# EAGLE design M_16PWM (EAGLE 6.4)
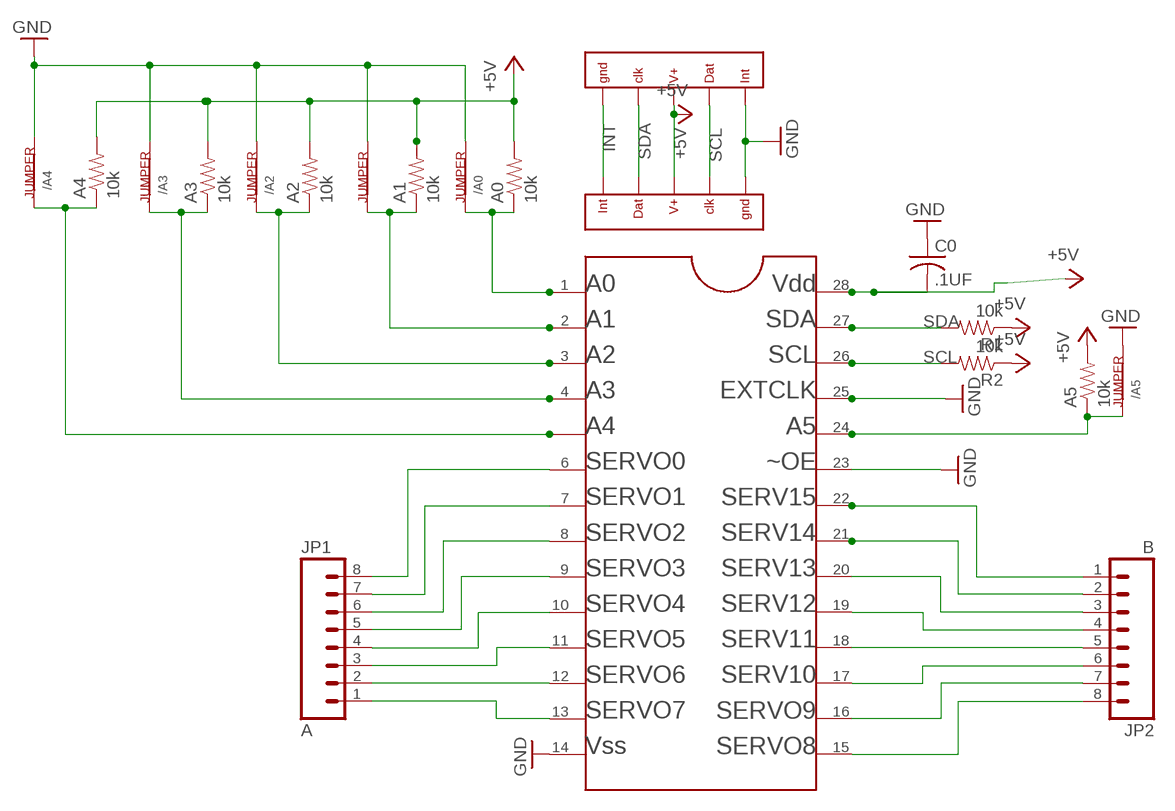
[diagram p0: schematic, sheet 1]

## Parts
/A0  JUMPER  [JUMPER]
/A1  JUMPER  [JUMPER]
/A2  JUMPER  [JUMPER]
/A3  JUMPER  [JUMPER]
/A4  JUMPER  [JUMPER]
/A5  JUMPER  [JUMPER]
A0  10k  RESISTOR0402-RES  [0402-RES]
A1  10k  RESISTOR0402-RES  [0402-RES]
A2  10k  RESISTOR0402-RES  [0402-RES]
A3  10k  RESISTOR0402-RES  [0402-RES]
A4  10k  RESISTOR0402-RES  [0402-RES]
A5  10k  RESISTOR0402-RES  [0402-RES]
C0  .1UF  C-USC0603  [C0603]
JP1  A  M081X08  [1X08]
JP2  B  M081X08  [1X08]
R1  10k  RESISTOR0402-RES  [0402-RES]
R2  10k  RESISTOR0402-RES  [0402-RES]
U$1  PCA9685PW  [TSSOP28]
U$2  050-5  [050-5]
U$3  050-5  [050-5]

## Nets
+5V: A0.2 A1.2 A2.2 A3.2 A4.2 A5.2 C0.2 R1.1 R2.1 U$1.28 U$2.P$3 U$3.P$3
GND: /A0.2 /A1.2 /A2.2 /A3.2 /A4.2 /A5.2 C0.1 U$1.14 U$1.23 U$1.25 U$2.P$5 U$3.P$1
INT: U$2.P$1 U$3.P$5
N$1: JP1.8 U$1.6
N$2: JP1.7 U$1.7
N$3: JP1.6 U$1.8
N$4: JP1.5 U$1.9
N$5: JP1.4 U$1.10
N$6: JP1.3 U$1.11
N$7: JP1.2 U$1.12
N$8: JP1.1 U$1.13
N$9: /A5.1 A5.1 U$1.24
N$10: JP2.8 U$1.15
N$11: JP2.7 U$1.16
N$12: JP2.6 U$1.17
N$13: JP2.5 U$1.18
N$14: JP2.4 U$1.19
N$15: JP2.3 U$1.20
N$16: JP2.1 U$1.22
N$17: JP2.2 U$1.21
N$19: /A0.1 A0.1 U$1.1
N$20: /A4.1 A4.1 U$1.5
N$21: /A2.1 A2.1 U$1.3
N$22: /A3.1 A3.1 U$1.4
N$23: /A1.1 A1.1 U$1.2
SCL: R2.2 U$1.26 U$2.P$4 U$3.P$2
SDA: R1.2 U$1.27 U$2.P$2 U$3.P$4

## Library data of the parts
/A0 /A1-/A5 = z_ML_stuff:JUMPER; ATT: r#
A0 A1-A5 R1 R2 = SparkFun-Resistors:RESISTOR: Resistor Basic schematic elements and footprints for 0603, 1206, and PTH resistors.
C0 = resistor:C-US: CAPACITOR, American symbol
JP1 JP2 = SparkFun-Connectors:M08: Header 8 Standard 8-pin 0.1" header. Use with straight break away headers (SKU : PRT-00116), right angle break away headers (PRT-00553), swiss pins (PRT-00743), machine pins (PRT-00117), and female headers (PRT-00115).
U$1 = SparkFun-DigitalIC:PCA9685PW: I2C_16-CHANNEL_LED_DRIVER http://www.nxp.com/documents/data_sheet/PCA9685.pdf
U$2 U$3 = zz-upenn:050-5

## Board
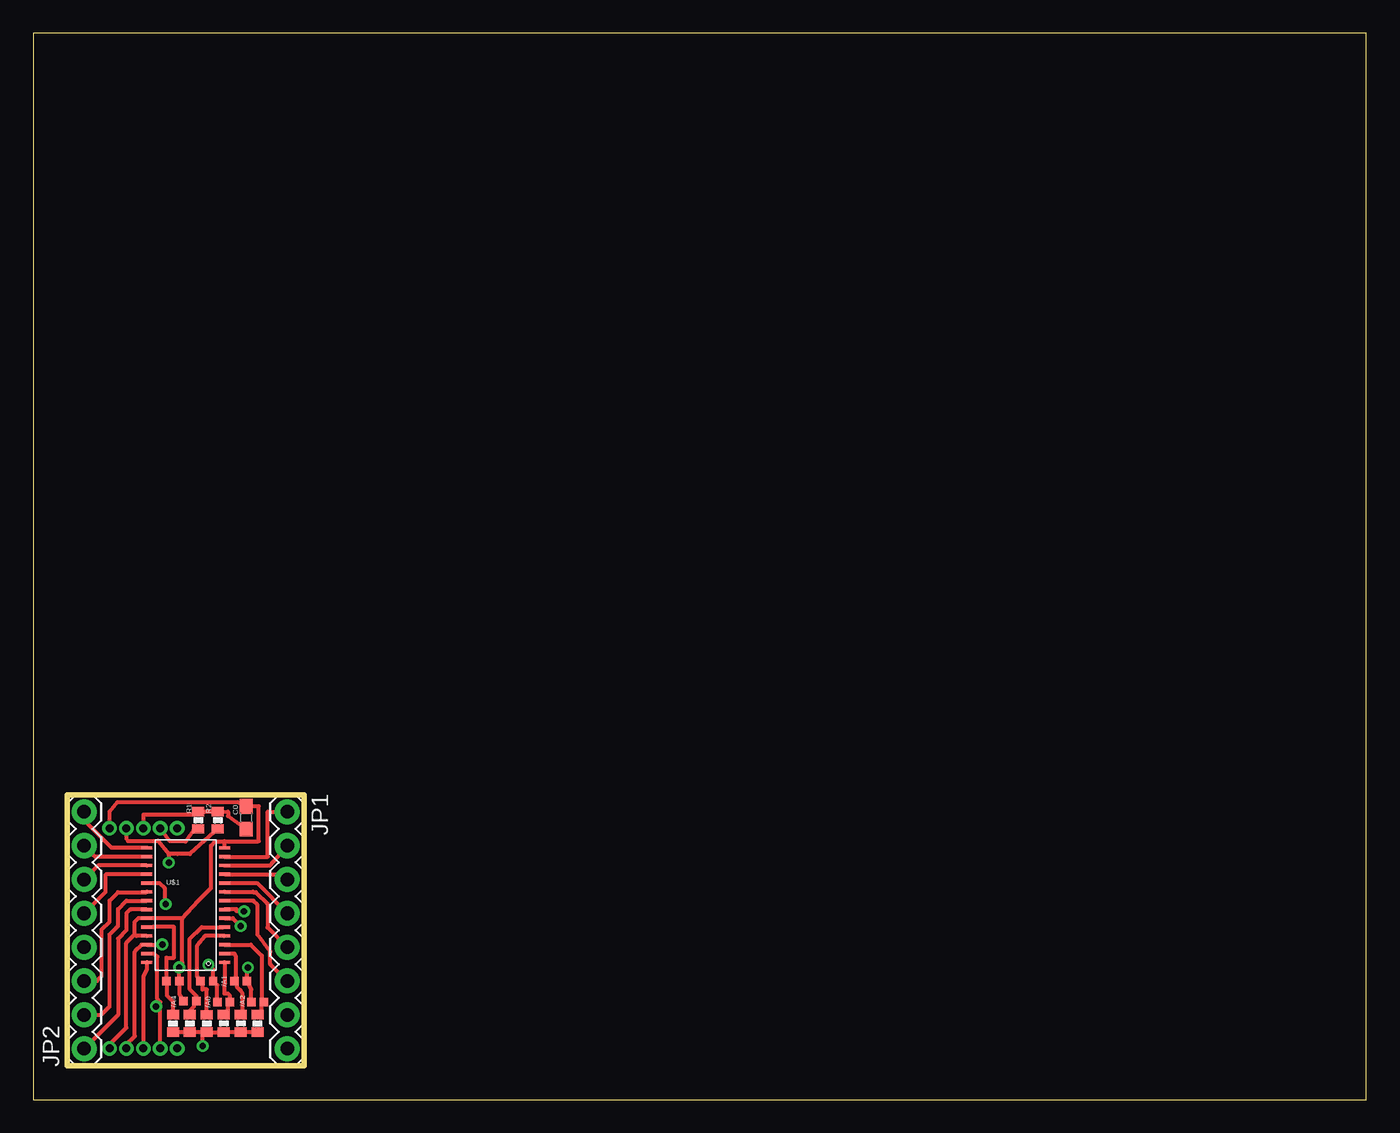
[diagram p1: board, top side]
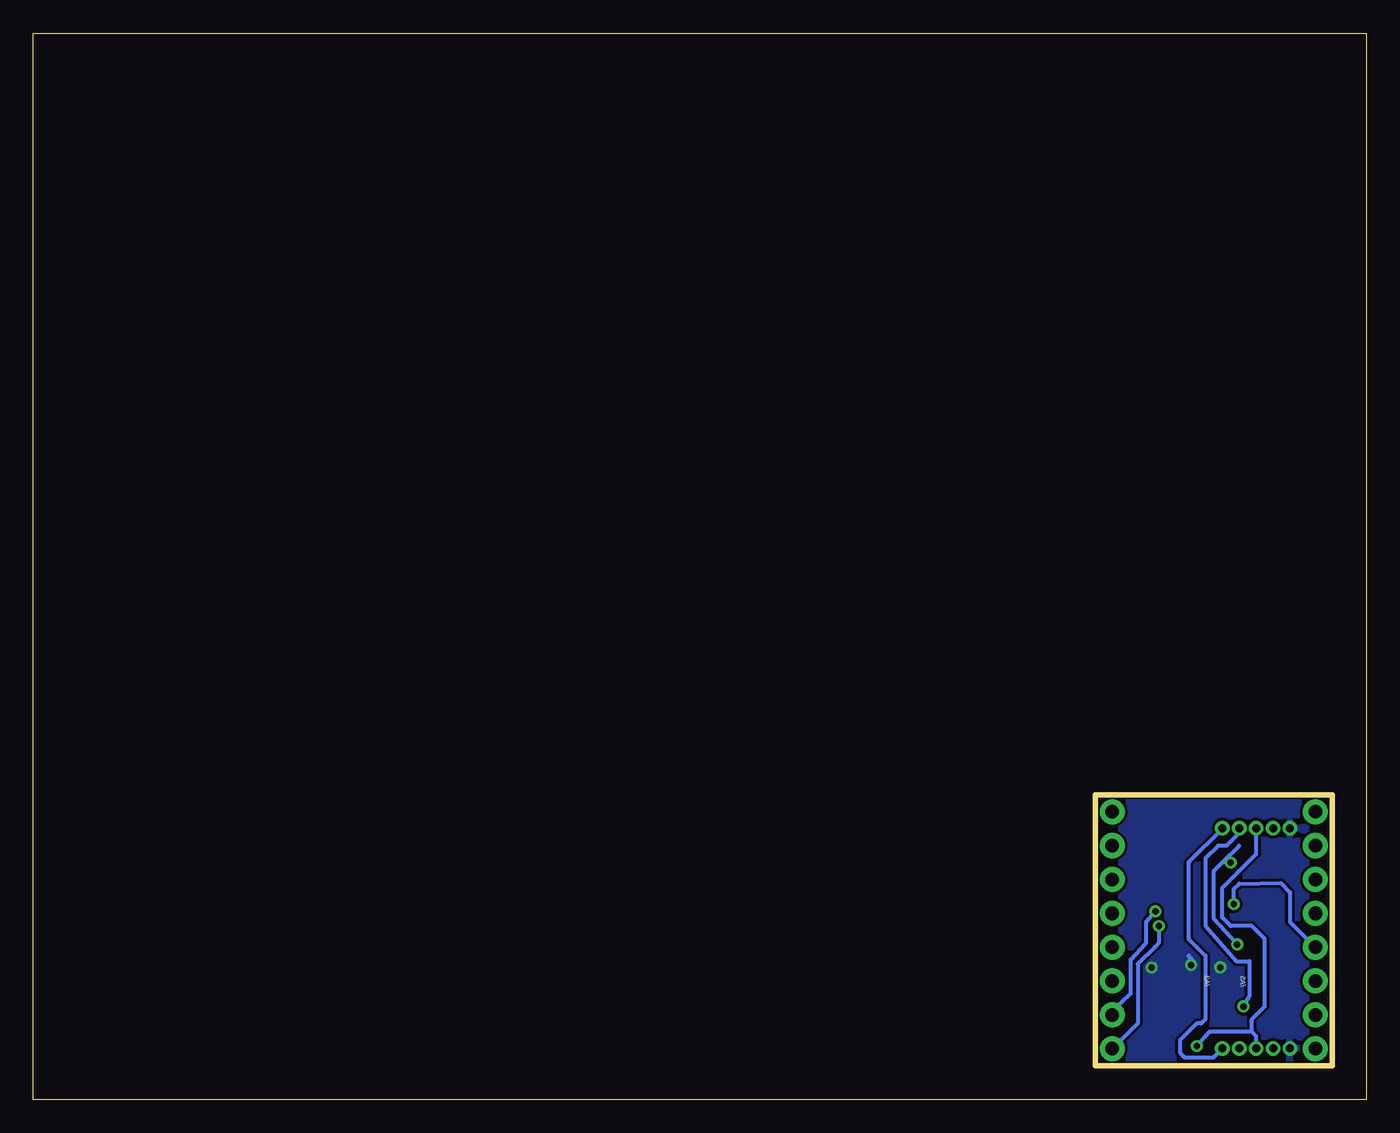
[diagram p2: board, bottom side, seen from below]

Size 100 x 80 mm. Coordinates in mm from the lower left corner, seen from the top.
Outline: 0,0 100,0 100,80 0,80 0,0
Outline: 2.54,2.54 20.32,2.54 20.32,22.86 2.54,22.86 2.54,2.54
Copper layers (1*16): Top 0.035mm / dielectric 1.5mm / Bottom 0.035mm
Design rules "default *": minimum track width 6mil, minimum drill 6mil, track to track 8mil, track to pad 8mil, pad to pad 8mil, via to via 8mil, smd to smd 8mil, copper to edge 4mil, drill to drill 8mil, minimum pad ring 10mil, minimum via ring 8mil, stop-mask expansion 2mil, vias tented up to drill 0mil, thermal gap 10mil

### Footprints (pad centres in the part's own frame; a part is rotated, then mirrored left to right if it is on the bottom)
JUMPER = smd 0.635 x 0.635: 1 -0.476,0; 2 0.476,0
0402-RES = smd 0.7 x 0.9: 1 -0.65,0; 2 0.65,0
C0603 = smd 1.1 x 1: 1 -0.85,0; 2 0.85,0
1X08 = drill 1.016 pad 1.88: 1 0,0; 2 2.54,0; 3 5.08,0; 4 7.62,0; 5 10.16,0; 6 12.7,0; 7 15.24,0; 8 17.78,0
TSSOP28 = smd 0.8 x 0.25: 1 -2.921,4.623; 2 -2.921,3.962; 3 -2.921,3.302; 4 -2.921,2.642; 5 -2.921,1.981; 6 -2.921,1.321; 7 -2.921,0.66; 8 -2.927,0; 9 -2.921,-0.66; 10 -2.921,-1.321; 11 -2.921,-1.981; 12 -2.921,-2.642; 13 -2.921,-3.302; 14 -2.921,-3.962; 15 2.921,-3.962; 16 2.921,-3.302; 17 2.921,-2.642; 18 2.921,-1.981; 19 2.921,-1.321; 20 2.921,-0.66; 21 2.927,0; 22 2.921,0.66; 23 2.921,1.321; 24 2.921,1.981; 25 2.921,2.642; 26 2.921,3.302; 27 2.921,3.962; 28 2.921,4.623
050-5 = drill 0.6 pad 0.711: P$1 0,0 | drill 0.6 pad 0.737: P$2 1.27,0; P$3 2.54,0; P$4 3.81,0; P$5 5.08,0

### Placement (x,y rotation side)
/A0  14.29,7.3 180 top
/A1  15.56,8.89 0 top
/A2  16.83,7.3 180 top
/A3  13.02,8.89 0 top
/A4  11.75,7.37 180 top
/A5  10.48,8.89 0 top
A0  14.29,5.72 270 top
A1  15.56,5.72 270 top
A2  16.83,5.71 270 top
A3  13.01,5.71 270 top
A4  11.75,5.71 270 top
A5  10.48,5.71 270 top
C0  15.96,21.15 270 top
JP1  19.05,21.59 270 top
JP2  3.81,3.81 90 top
R1  12.38,20.95 270 top
R2  13.85,20.95 270 top
U$1  11.43,14.92 180 top
U$2  10.79,20.36 180 top
U$3  5.71,3.83 0 top

### Tracks (layer width: path | path; a pad name or v marks a point on that pad's centre or on a via)
+5V  (via drill 0.48)
  Top 0.305: A5.2 A4.2 | A4.2 | A4.2 A3.2 | A3.2 A0.2 A1.2 A2.2 | v12.71,4.01 12.7,4.75 A3.2 | U$1.28 8.51,9.78 8.26,9.21 U$3.P$3 | U$2.P$3 8.28,21.38 12.14,21.38 R1.1 R2.1 14.61,21.59 14.61,21.27 C0.2
  Bottom 0.305: U$3.P$3 8.26,4.76 8.57,5.08 | 8.57,5.08 11.73,5.08 A4.2 11.76,5.07 v12.71,4.01 | 8.57,5.08 8.57,6.03 7.62,6.99 7.62,12.06 8.57,13.02 10.16,13.02 10.79,13.65 10.79,15.88 8.26,18.41 U$2.P$3
GND  (via drill 0.48)
  Top 0.305: /A4.2 10.95,7.94 /A5.2 v10.95,9.91 11.17,10.07 | U$1.25 7.72,12.28 7.62,12.38 | 7.62,12.38 7.62,13.34 7.89,13.6 U$1.23 11.17,13.6 11.17,10.07 | U$3.P$1 5.71,4.13 6.99,5.4 6.99,11.75 7.62,12.38 | U$2.P$5 5.71,21.59 6.31,22.32 15.33,22.32 C0.1 16.91,22 16.91,19.39 16.83,19.37 14.35,19.37 | /A0.2 13.81,8.57 /A3.2 13.49,9.74 v13.14,10.09 | /A1.2 16.03,8.73 16.19,8.57 | /A2.2 16.35,8.26 /A1.2 | /A1.2 16.03,9.66 v16.1,9.9 | 11.17,10.07 11.11,10.16 11.17,10.28 11.17,13.59 12.38,14.92 13.34,15.88 13.34,19.05 13.65,19.37 14.35,19.37 | U$1.14 14.35,19.37
  Bottom 0.305: v13.14,10.09 13.14,10.36 | 13.14,10.36 13.34,10.16 | v16.1,9.9 16.05,9.97 15.88,10.16 | 13.14,10.36 13.14,10.6 13.34,10.79 | v10.95,9.91 11.11,10.16
  pour Bottom: 2.54,22.86 20.32,22.86 20.32,2.54 2.54,2.54
INT
  Bottom 0.305: U$2.P$1 10.79,20.32 13.34,17.78 13.34,12.06 12.06,10.79 12.06,6.03 12.38,5.71 12.7,5.71 13.97,4.45 13.97,3.49 13.65,3.17 11.45,3.17 U$3.P$5
N$1  (via drill 0.48)
  Top 0.305: U$1.6 14.97,13.6 v15.56,13.02
  Bottom 0.305: v15.56,13.02 15.56,11.75 15.88,11.43 17.14,10.18 17.14,5.71 JP1.8
N$2  (via drill 0.48)
  Top 0.305: v15.81,14.12 15.24,14.12 15.24,14.29 14.38,14.29 U$1.7
  Bottom 0.305: JP1.7 19.05,6.67 17.66,7.95 17.66,10.49 16.51,11.75 16.51,13.34 v15.81,14.12
N$3
  Top 0.305: JP1.6 17.78,10.16 17.78,11.11 16.83,12.38 16.83,14.61 16.51,14.92 U$1.8
N$4
  Top 0.305: U$1.9 16.48,15.58 16.51,15.56 16.69,15.56 17.57,14.68 17.57,12.9 JP1.5
N$5
  Top 0.305: U$1.10 16.78,16.24 JP1.4
N$6
  Top 0.305: U$1.11 18.66,16.9 JP1.3
N$7
  Top 0.305: U$1.12 17.25,17.56 17.75,17.56 JP1.2
N$8
  Top 0.305: U$1.13 17.59,18.22 17.59,19.31 17.59,21.59 JP1.1
N$9
  Top 0.305: A5.1 10.48,7.33 10.03,7.79 10.03,8.87 /A5.1 10,10.64 10.55,10.64 10.55,12.94 8.97,12.94 U$1.24
N$10
  Top 0.305: U$1.15 5.88,18.89 4.13,20.64 4.13,21.27 JP2.8
N$11
  Top 0.305: U$1.16 4.64,18.22 JP2.7
N$12
  Top 0.305: U$1.17 4.86,17.56 JP2.6
N$13
  Top 0.305: U$1.18 5.47,16.9 5.4,16.83 5.4,15.56 JP2.5
N$14  (via drill 0.48)
  Top 0.305: U$1.19 9.45,16.24 9.84,15.88 9.84,14.66 v9.93,14.66
  Bottom 0.305: v9.93,14.66 9.94,15.8 9.53,16.19 6.41,16.25 5.71,15.56 5.71,13.34 JP2.4
N$15
  Top 0.305: JP2.3 4.76,8.89 5.13,9.27 5.13,12.77 5.71,13.34 5.71,14.92 6.35,15.56 8.48,15.56 U$1.20
N$16
  Top 0.305: U$1.22 7.28,14.26 6.99,13.97 6.99,12.7 6.35,12.06 6.35,6.35 JP2.1
N$17
  Top 0.305: JP2.2 5.08,6.35 5.71,6.99 5.71,12.38 6.35,13.02 6.35,14.29 6.99,14.92 U$1.21
N$19
  Top 0.305: U$1.1 14.35,8.64 14.35,8.58 14.35,7.95 14.61,7.94 14.76,7.78 /A0.1 14.61,7.14 14.61,6.67 14.3,6.37 A0.1
N$20
  Top 0.305: A4.1 11.76,6.68 12.06,6.99 12.06,7.46 /A4.1 12.22,7.78 11.75,8.26 11.75,12.06 12.64,12.94 14.21,12.94 U$1.5
N$21
  Top 0.305: U$1.3 16.32,11.62 17.14,10.79 17.14,7.46 /A2.1 17.14,7.14 17.14,6.67 16.84,6.37 A2.1
N$22
  Top 0.305: A3.1 13.02,8.25 13.02,8.26 12.7,8.26 12.7,8.73 /A3.1 12.3,9.21 12.3,11.58 12.89,12.28 12.92,12.28 U$1.4
N$23
  Top 0.305: A1.1 15.65,6.51 15.65,8.02 15.53,8.19 15.53,8.2 15.26,8.47 15.26,8.59 15.08,8.77 /A1.1 15.18,9.05 15.18,10.79 15.07,10.96 U$1.2
SCL  (via drill 0.48)
  Top 0.305: U$3.P$2 6.99,4.13 7.62,4.76 7.62,11.11 8.13,11.62 U$1.26 9.65,11.62 v9.67,11.64 | U$2.P$4 6.99,19.57 7.09,19.41 9.11,19.41 9.37,19.41 10.15,18.42 | R2.2 13.57,20.1 11.75,18.41 10.79,18.41 10.15,18.42 | 10.15,18.42 v10.16,17.78
  Bottom 0.305: v9.67,11.64 11.43,13.54 11.43,17.14 10.79,17.78 | v10.16,17.78 10.79,17.78 | 10.79,17.78 9.53,19.05
SDA  (via drill 0.48)
  Top 0.305: U$3.P$4 9.53,6.99 | U$1.27 9.04,10.96 9.31,10.72 9.31,7.55 9.53,7.3 9.53,6.99 | v9.21,6.99 9.53,6.99 | R1.2 12.06,20.32 11.43,19.37 10.27,19.38 U$2.P$2
  Bottom 0.305: U$2.P$2 9.53,20 10.48,19.05 11.11,19.05 12.06,18.1 12.06,13.02 9.73,10.39 8.76,10.39 8.76,7.75 v9.21,6.99

### Text on the board
bNames: /A5 | /A3